# Altium schematic sheet bms_schematic.SchDoc
size 420 x 297 mm; SheetNumber: 1; SheetTotal: 1
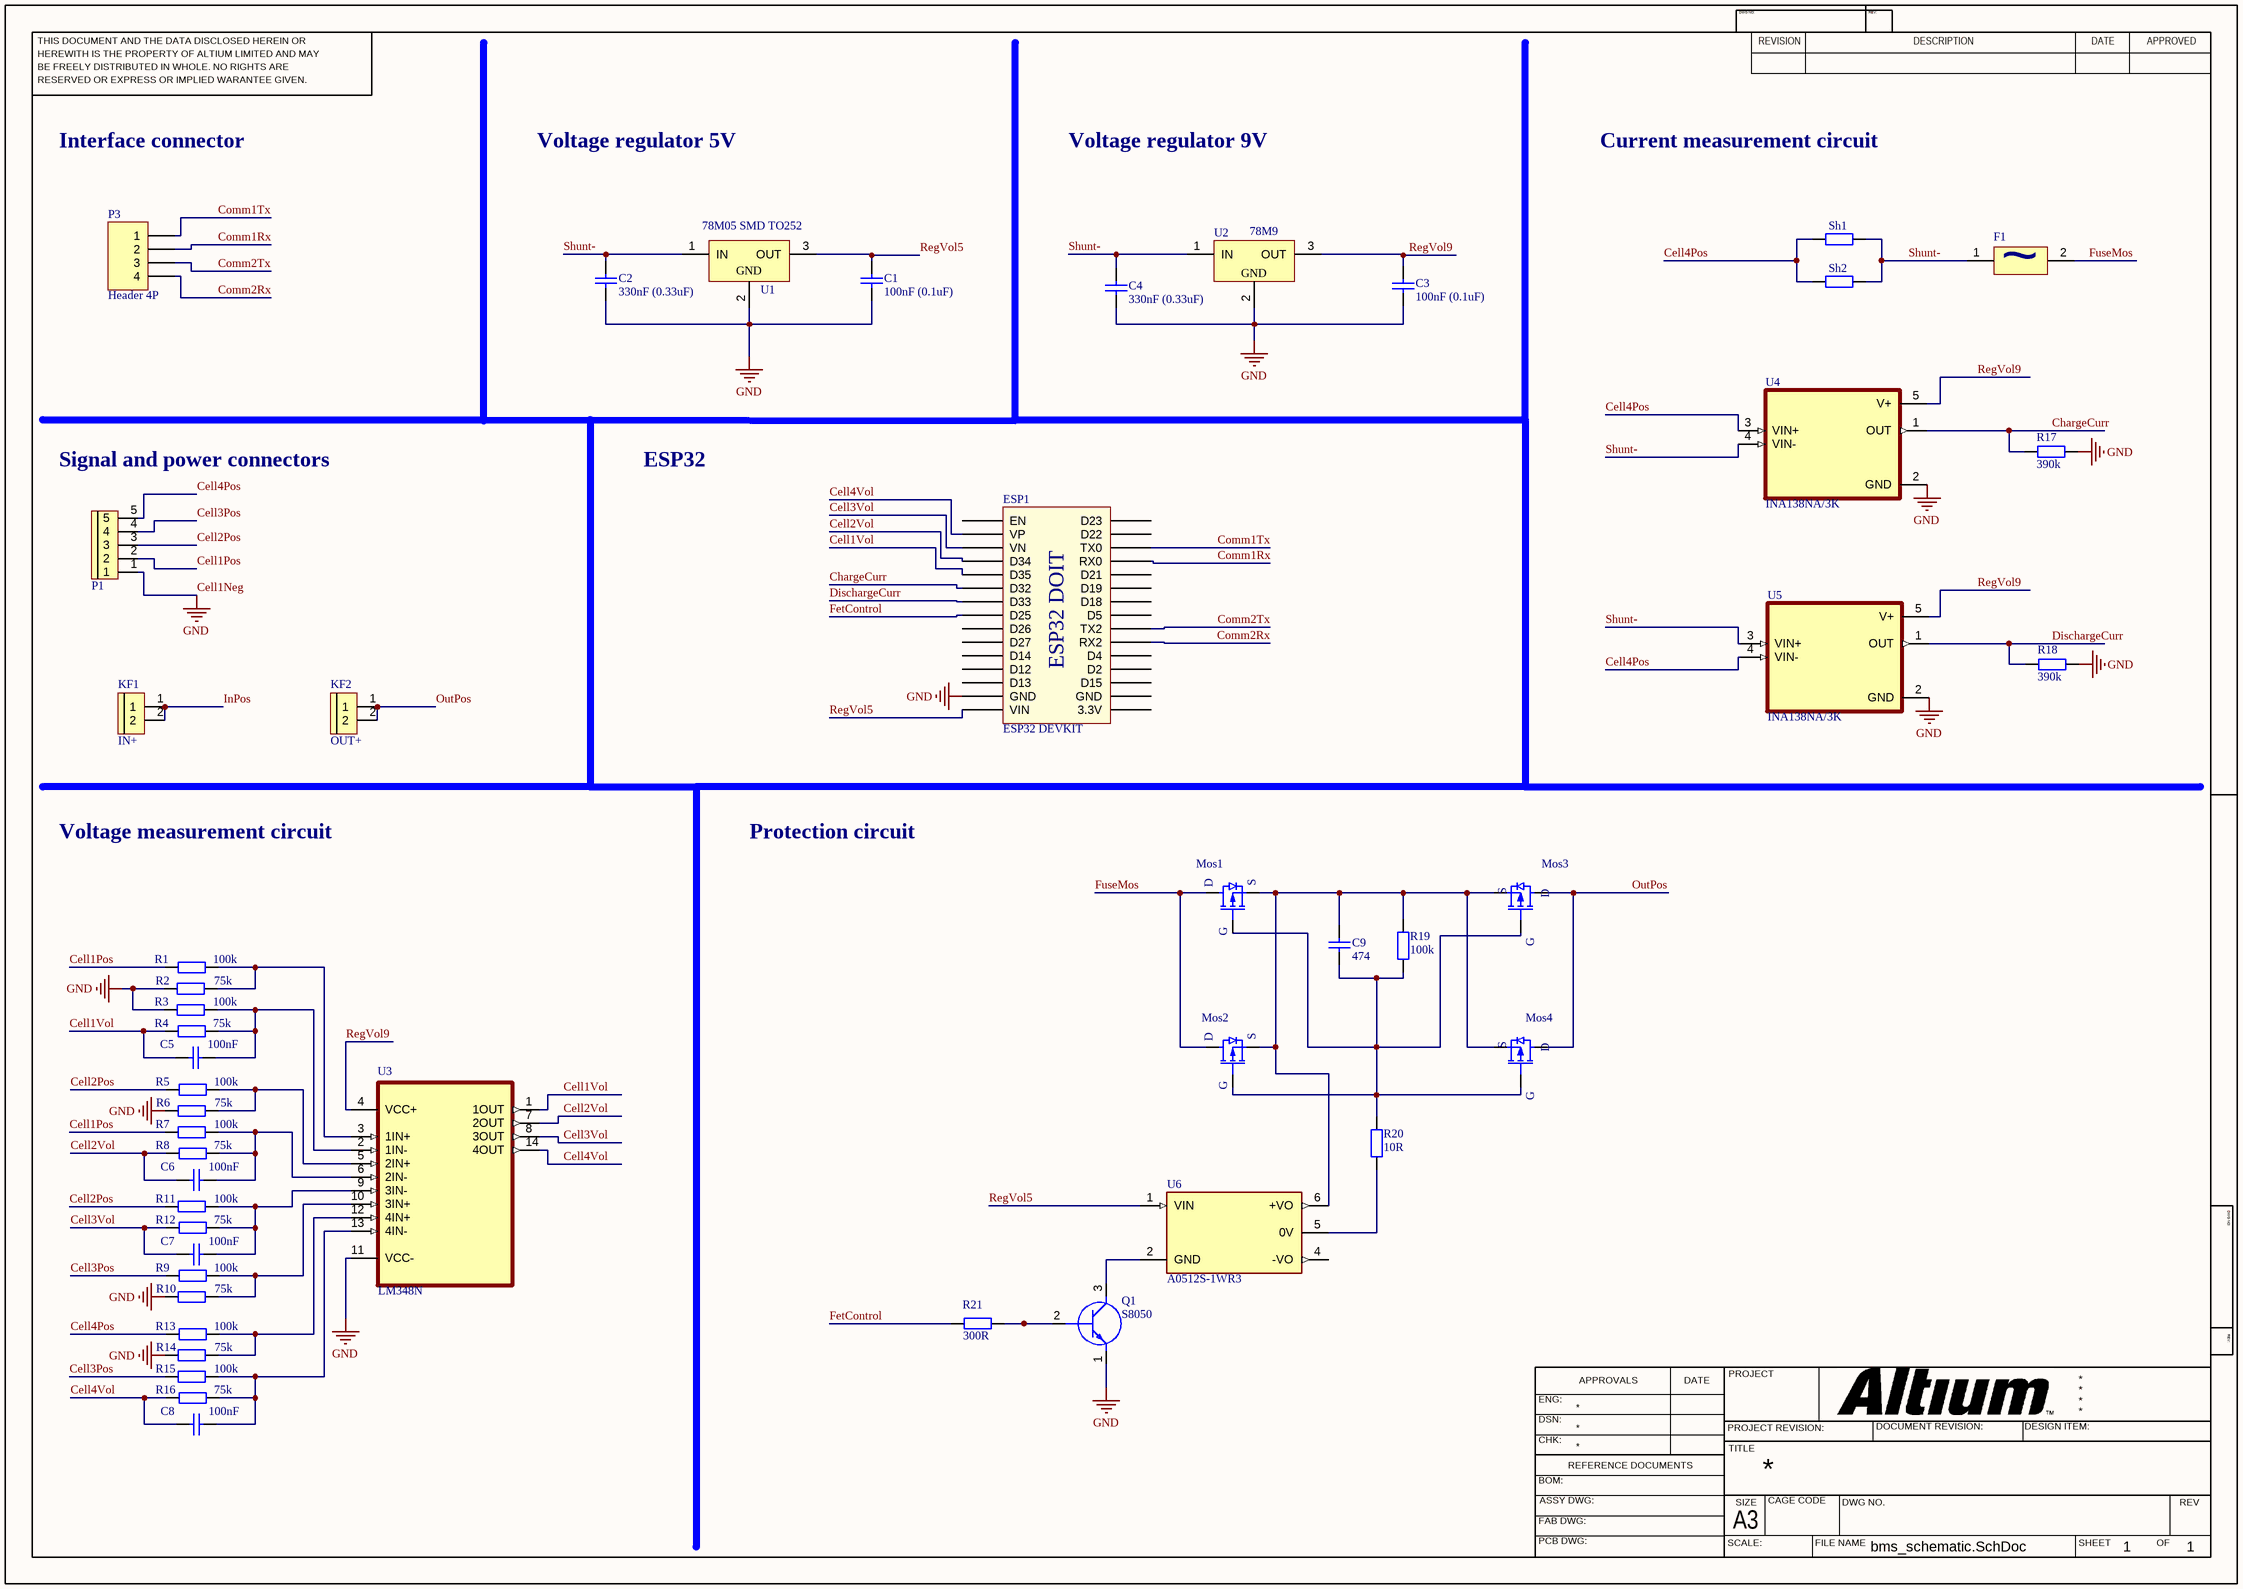
[diagram p0: bms_schematic.SchDoc]

## Parts
C1  100nF (0.1uF)  [tu 0805]
C2  330nF (0.33uF)  [tu 0805]
C3  100nF (0.1uF)  [tu 0805]
C4  330nF (0.33uF)  [tu 0805]
C5  100nF  [tu 0805]
C6  100nF  [tu 0805]
C7  100nF  [tu 0805]
C8  100nF  [tu 0805]
C9  474  [tu 0805]
ESP1  ESP32 DEVKIT  [ESP32 WROOM 32 KIT]
F1  (no value)  [FUSE_3A_HOLDER]
KF1  IN+  [Con 2 KF301 5.08]
KF2  OUT+  [Con 2 KF301 5.08]
Mos1  AOD403  [TO-252-3]  (value not drawn)
Mos2  AOD403  [TO-252-3]  (value not drawn)
Mos3  AOD403  [TO-252-3]  (value not drawn)
Mos4  AOD403  [TO-252-3]  (value not drawn)
P1  CON 5 EDG5.08  [CON 5 5EDG5.08]  (value not drawn)
P3  Header 4P  [HDR1X4]
Q1  S8050  [S8050]
R1  100k  [tro smd 0805]
R2  75k  [tro SMD 0805]
R3  100k  [tro smd 0805]
R4  75k  [tro SMD 0805]
R5  100k  [tro smd 0805]
R6  75k  [tro SMD 0805]
R7  100k  [tro smd 0805]
R8  75k  [tro SMD 0805]
R9  100k  [tro smd 0805]
R10  75k  [tro SMD 0805]
R11  100k  [tro smd 0805]
R12  75k  [tro SMD 0805]
R13  100k  [tro smd 0805]
R14  75k  [tro SMD 0805]
R15  100k  [tro smd 0805]
R16  75k  [tro SMD 0805]
R17  390k  [Tro SMD 0805]
R18  390k  [Tro SMD 0805]
R19  100k  [tro smd 0805]
R20  10R  [tro smd 0805]
R21  300R  [Tro SMD 0805]
Sh1  Shunt  [Shunt]  (value not drawn)
Sh2  Shunt  [Shunt]  (value not drawn)
U1  78M05 SMD TO252  [TO252]
U2  78M9  [TO252]
U3  LM348N  [DIP254P762X508-14]
U4  INA138NA/3K  [SOT95P280X145-5N]
U5  INA138NA/3K  [SOT95P280X145-5N]
U6  A0512S-1WR3  [CONV_A0512S-1WR3]

## Nets
Cell1Neg: C1.1 C2.1 C3.1 C4.1 ESP1.14(GND) P1.1 Q1.1(E) R2.1 R3.1 R6.1 R10.1 R14.1 R17.2 R18.2 U1.2(GND) U2.2(GND) U3.11(VCC-) U4.2(GND) U5.2(GND)  [also labelled GND]
Cell1Pos: P1.2 R1.1 R7.1
Cell1Vol: C5.1 ESP1.5(D35) R4.1 U3.1(1OUT)
Cell2Pos: P1.3 R5.1 R11.1
Cell2Vol: C6.1 ESP1.4(D34) R8.1 U3.7(2OUT)
Cell3Pos: P1.4 R9.1 R15.1
Cell3Vol: C7.1 ESP1.3(VN) R12.1 U3.8(3OUT)
Cell4Pos: P1.5 R13.1 Sh1.1 Sh2.1 U4.3(VIN+) U5.4(VIN-)
Cell4Vol: C8.1 ESP1.2(VP) R16.1 U3.14(4OUT)
ChargeCurr: ESP1.6(D32) R17.1 U4.1(OUT)
Comm1Rx: ESP1.27(RX0) P3.2
Comm1Tx: ESP1.28(TX0) P3.1
Comm2Rx: ESP1.21(RX2) P3.4
Comm2Tx: ESP1.22(TX2) P3.3
DischargeCurr: ESP1.7(D33) R18.1 U5.1(OUT)
FetControl: ESP1.8(D25) R21.1
FuseMos: F1.2 Mos1.2(D) Mos2.2(D)
InPos: KF1.1 KF1.2
OutPos: KF2.1 KF2.2 Mos3.2(D) Mos4.2(D)
RegVol5: C1.2 ESP1.15(VIN) U1.3(OUT) U6.1(VIN)
RegVol9: C3.2 U2.3(OUT) U3.4(VCC+) U4.5(V+) U5.5(V+)
Shunt-: C2.2 C4.2 F1.1 Sh1.2 Sh2.2 U1.1(IN) U2.1(IN) U4.4(VIN-) U5.3(VIN+)
NetC5_2: C5.2 R3.2 R4.2 U3.2(1IN-)
NetC6_2: C6.2 R7.2 R8.2 U3.6(2IN-)
NetC7_2: C7.2 R11.2 R12.2 U3.9(3IN-)
NetC8_2: C8.2 R15.2 R16.2 U3.13(4IN-)
NetC9_1: C9.1 Mos1.3(S) Mos2.3(S) Mos3.3(S) Mos4.3(S) R19.2 U6.6(+VO)
NetC9_2: C9.2 Mos1.1(G) Mos2.1(G) Mos3.1(G) Mos4.1(G) R19.1 R20.2
NetQ1_2: Q1.2(B) R21.2
NetQ1_3: Q1.3(C) U6.2(GND)
NetR1_2: R1.2 R2.2 U3.3(1IN+)
NetR5_2: R5.2 R6.2 U3.5(2IN+)
NetR9_2: R9.2 R10.2 U3.10(3IN+)
NetR13_2: R13.2 R14.2 U3.12(4IN+)
NetR20_1: R20.1 U6.5(0V)

Not connected (* = marked no-connect by the designer): ESP1 1(EN) 9(D26) 10(D27) 11(D14) 12(D12) 13(D13) 16(3.3V) 17(GND) 18(D15) 19(D2) 20(D4) 23(D5) 24(D18) 25(D19) 26(D21) 29(D22) 30(D23); U6 4(-VO)

## Notes on the sheet
- Interface connector
- Voltage regulator 5V
- Voltage regulator 9V
- Current measurement circuit
- (near P1) Signal and power connectors
- ESP32
- Voltage measurement circuit
- Protection circuit
- THIS DOCUMENT AND THE DATA DISCLOSED HEREIN OR
- HEREWITH IS THE PROPERTY OF ALTIUM LIMITED AND MAY
- DWG NO:
- REVISION
- REV:
- DESCRIPTION
- DATE
- APPROVED
- BE FREELY DISTRIBUTED IN WHOLE. NO RIGHTS ARE
- RESERVED OR EXPRESS OR IMPLIED WARANTEE GIVEN.
- ENG:
- APPROVALS
- PROJECT
- DSN:
- CHK:
- REFERENCE DOCUMENTS
- PROJECT REVISION:
- TITLE
- DOCUMENT REVISION:
- DESIGN ITEM:
- BOM:
- FAB DWG:
- PCB DWG:
- ASSY DWG:
- SCALE:
- A3
- SIZE
- CAGE CODE
- FILE NAME
- DWG NO.
- SHEET
- OF
- REV
- (in symbol ESP32 WROOM 32 KIT) ESP32 DOIT
- (in symbol FUSE_PbWire) ~

## Library data of the parts
C1-C8 = Tu 0805 331 50V 10%: Dán; Don_Vi: Con; So_Chan: 2; Ten_Linh_Kien: Tụ 0805 331-330P 10% 50V; Ma_Hang: MH004562; Chung_Loai: Dán; Kieu_Chan: *
C9 = Tu 0805 474 50V 10%: Dán; Don_Vi: Con; So_Chan: 2; Ten_Linh_Kien: Tụ 0805 474-470nF 50V 10%; Ma_Hang: MH006116; Chung_Loai: Dán; Kieu_Chan: *
ESP1 = ESP32 WROOM 32 KIT
F1 = FUSE_PbWire: PB wire fuse; Solder: SMT; CompanyID: VT-xxxx
KF1 KF2 = CON 2 KF301: Cắm; Ma_Hang: MH000987; Ten_Linh_Kien: CON 2 KF301-2P 5.08MM Xanh Dương; Don_Vi: Con; Chung_Loai: Cắm; Ghi_Chu: *; Kieu_Chan: *
P1 = CON 5 EDG5.08: Cắm; Ten_Linh_Kien: CON 5 2EDG5.08-5P 5.08MM ( Xanh Cong); Ma_Hang: MH003589; Kieu_Chan: *; Don_Vi: Con; Ghi_Chu: *; Chung_Loai: Cắm
P3 = Header 4x1: Header, 4 Pin Pitch 2.54mm; MPN: S1012EC-40-ND; CompanyID: VT-00125; Solder: WAVE; Value: Header 4P
Q1 = S8050: Transistor BJT NPN; Manufacturer_Name: MCC; Datasheet Link: https://datasheet.datasheetarchive.com/originals/distributors/Datasheets-316/603661.pdf; Height: 4.7mm; Manufacturer_Part_Number: S8050
R1 R3 R5 R7 R9 R11 R13 R15 R19 = Tro 0805 5% 100k: Dán; Don_Vi: Con; So_Chan: 2; Ten_Linh_Kien: Trở 0805 5% 100k; Ma_Hang: MH005250; Chung_Loai: Dán; Kieu_Chan: *
R2 R4 R6 R8 R10 R12 R14 R16 = Tro 0805 5% 75k: Dán; Don_Vi: Con; So_Chan: 2; Ten_Linh_Kien: Trở 0805 5% 75k; Ma_Hang: MH005327; Chung_Loai: Dán; Kieu_Chan: *
R17 R18 = Tro 0805 5% 390k: Dán; Don_Vi: Con; So_Chan: 2; Ten_Linh_Kien: Trở 0805 5% 390k; Ma_Hang: MH005338; Chung_Loai: Dán; Kieu_Chan: *
R20 = Tro 0805 5% 10R: Dán; Don_Vi: Con; So_Chan: 2; Ten_Linh_Kien: Trở 0805 5% 10R; Ma_Hang: MH005240; Chung_Loai: Dán; Kieu_Chan: *
R21 = Tro 0805 5% 300R: Dán; Don_Vi: Con; So_Chan: 2; Ten_Linh_Kien: Trở 0805 5% 300R; Ma_Hang: MH005335; Chung_Loai: Dán; Kieu_Chan: *
U1 = 78M05 SMD TO252: Dán; Don_Vi: Con; Ten_Linh_Kien: 78M05 TO252; Ma_Hang: MH001917; Ghi_Chu: *; Kieu_Chan: *; Chung_Loai: Dán
U2 = 78M09 SMD TO252: Dán; Ten_Linh_Kien: 78M09 TO252; Don_Vi: Con; Ma_Hang: MH004847; Ghi_Chu: *; Kieu_Chan: *; Chung_Loai: Dán
U3 = LM348N: General Purpose Amplifier 4 Circuit 14-DIP; MF: STMicroelectronics; Price: None; Package: DIP-14 Raytheon; DigiKey-Purchase-URL: https://snapeda.com/shop?store=DigiKey&id=2765155; Availability: Unavailable; MP: LM348N; Value: *; SnapEDA_Link: https://www.snapeda.com/parts/LM348N/STMicroelectronics/view-part/2765155/?ref=snap
U4 U5 = INA138NA/3K: 2.7 to 36V, 800kHz Variable gain current sense amplifier 5-SOT-23 -40 to 125; MF: Texas Instruments; Package: SOT-23-5 Texas Instruments; DigiKey-Purchase-URL: https://snapeda.com/shop?store=DigiKey&id=11314; MP: INA138NA/3K; Mouser-Purchase-URL: https://snapeda.com/shop?store=Mouser&id=11314; Availability: Good; Price: None; Arrow_Electronics-Purchase-URL: https://snapeda.com/shop?store=Arrow+Electronics&id=11314; Texas_Instruments-Purchase-URL: https://snapeda.com/shop?store=Texas+Instruments&id=11314; Value: *; SnapEDA_Link: https://www.snapeda.com/parts/INA138NA/3K/Texas%20Instruments/view-part/11314/?ref=snap; BuyPart: https://www.snapeda.com/parts/INA138NA/3K/Texas%20Instruments/view-part/11314/?ref=eda
U6 = A0512S-1WR3: Isolated Module DC DC Converter 2 Output 12V -12V 42mA, 42mA 4.5V - 5.5V Input; MF: Mornsun America, LLC; SnapEDA_Link: https://www.snapeda.com/parts/A0512S-1WR3/MORNSUN/view-part/5823749/?ref=snap; Value: *; Purchase-URL: https://pricing.snapeda.com/search/part/A0512S-1WR3/?ref=eda; Check_prices: https://www.snapeda.com/parts/A0512S-1WR3/MORNSUN/view-part/5823749/?ref=eda; Price: None; Availability: In Stock; MP: A0512S-1WR3; Package: SIP-5-5 MORNSUN